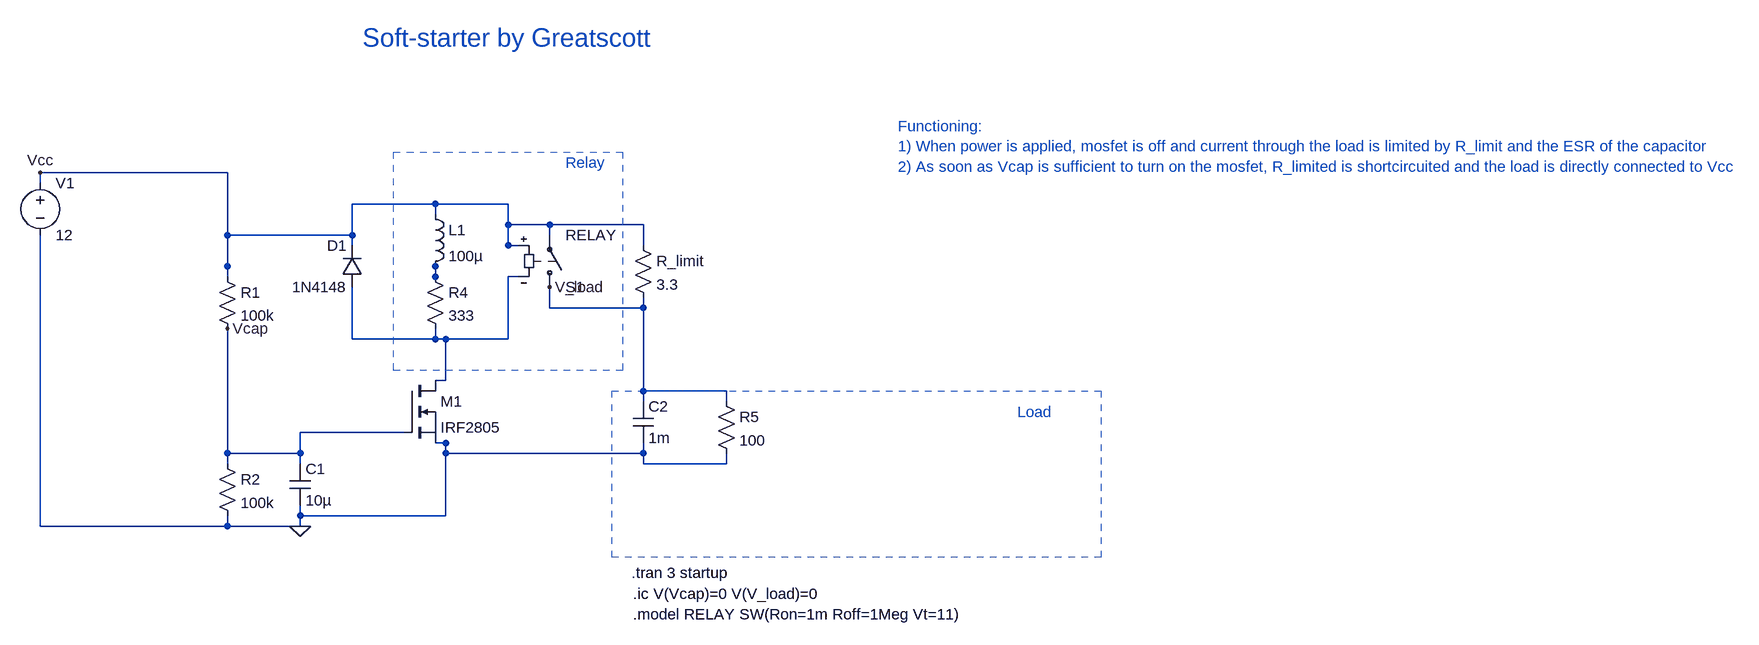
[diagram p0: schematic soft-starter-12V.asc]
soft-starter-12V.asc, the LTspice schematic file:
Version 4.1
SHEET 1 2440 680
WIRE 144 288 144 304
WIRE 672 192 672 208
WIRE 352 192 368 192
WIRE 32 304 32 320
WIRE 800 208 800 224
WIRE -256 -128 -256 -112
WIRE 144 304 144 320
WIRE 144 320 32 320
WIRE 144 304 368 304
WIRE 368 304 368 192
WIRE 368 192 368 208
WIRE 368 208 672 208
WIRE 672 208 672 224
WIRE 672 224 800 224
WIRE 32 320 -256 320
WIRE -256 320 -256 -112
FLAG 144 320 0
WIRE 352 -80 352 -64
WIRE 352 -64 352 -80
WIRE 224 -48 224 -32
WIRE 352 96 368 96
WIRE 352 16 352 32
WIRE 480 -64 464 -64
WIRE 224 -32 224 32
WIRE 224 32 352 32
WIRE 352 32 368 32
WIRE 368 32 368 96
WIRE 352 32 464 32
WIRE 464 32 464 -64
WIRE 672 128 672 112
WIRE 800 128 800 112
WIRE 672 -32 672 -16
WIRE 528 -48 528 -32
WIRE 672 112 672 -16
WIRE 672 112 800 112
WIRE 672 -16 528 -16
WIRE 528 -16 528 -32
FLAG 528 -48 V_load
WIRE 144 224 144 208
WIRE 304 176 288 176
WIRE 32 16 32 32
WIRE 32 224 32 208
WIRE 144 208 32 208
WIRE 32 208 32 32
WIRE 144 208 144 176
WIRE 144 176 288 176
FLAG 32 16 Vcap
WIRE 224 -112 224 -128
WIRE 352 -160 352 -176
WIRE 32 -64 32 -80
WIRE 672 -112 672 -128
WIRE 528 -128 528 -144
WIRE 480 -112 464 -112
WIRE -256 -208 -256 -224
WIRE 224 -128 224 -176
WIRE 224 -176 352 -176
WIRE 352 -176 464 -176
WIRE 464 -176 464 -112
WIRE 464 -112 464 -144
WIRE 464 -144 528 -144
WIRE 528 -144 672 -144
WIRE 672 -144 672 -128
WIRE 224 -128 32 -128
WIRE 32 -128 32 -80
WIRE 32 -80 32 -224
WIRE 32 -224 -256 -224
FLAG -256 -224 Vcc
SYMBOL res 16 -80 R0
SYMATTR InstName R1
SYMATTR Value 100k
SYMBOL res 16 208 R0
SYMATTR InstName R2
SYMATTR Value 100k
SYMBOL cap 128 224 R0
SYMATTR InstName C1
SYMATTR Value 10µ
SYMBOL nmos 304 96 R0
SYMATTR InstName M1
SYMATTR Value IRF2805
SYMBOL ind 336 -176 R0
SYMATTR InstName L1
SYMATTR Value 100µ
SYMBOL diode 240 -48 R180
WINDOW 0 24 64 Left 2
WINDOW 3 24 0 Left 2
SYMATTR InstName D1
SYMATTR Value 1N4148
SYMBOL res 656 -128 R0
SYMATTR InstName R_limit
SYMATTR Value 3.3
SYMBOL voltage -256 -224 R0
WINDOW 123 0 0 Left 0
WINDOW 39 0 0 Left 0
SYMATTR InstName V1
SYMATTR Value 12
SYMBOL sw 528 -32 M180
SYMATTR InstName S1
SYMATTR Value RELAY
SYMBOL res 336 -80 R0
SYMATTR InstName R4
SYMATTR Value 333
SYMBOL cap 656 128 R0
SYMATTR InstName C2
SYMATTR Value 1m
SYMBOL res 784 112 R0
SYMATTR InstName R5
SYMATTR Value 100
TEXT 654 392 Left 2 !.tran 3 startup
TEXT 656 456 Left 2 !.model RELAY SW(Ron=1m Roff=1Meg Vt=11)
TEXT 656 424 Left 2 !.ic V(Vcap)=0 V(V_load)=0
TEXT 552 -240 Left 2 ;Relay
TEXT 240 -432 Left 4 ;Soft-starter by Greatscott
TEXT 1248 144 Left 2 ;Load
TEXT 1064 -296 Left 2 ;Functioning:\n1) When power is applied, mosfet is off and current through the load is limited by R_limit and the ESR of the capacitor\n2) As soon as Vcap is sufficient to turn on the mosfet, R_limited is shortcircuited and the load is directly connected to Vcc
RECTANGLE Normal 640 80 288 -256 2
RECTANGLE Normal 1376 368 624 112 2

The netlist it stands for:
* soft-starter-12V.asc
R1 Vcc Vcap 100k
R2 Vcap 0 100k
C1 Vcap 0 10µ
M1 N002 Vcap 0 0 IRF2805
L1 Vcc N001 100µ
D1 N002 Vcc 1N4148
R_limit Vcc V_load 3.3
V1 Vcc 0 12
S1 V_load Vcc Vcc N002 RELAY
R4 N001 N002 333
C2 V_load 0 1m
R5 V_load 0 100
.model D D
.lib standard.dio
.model NMOS NMOS
.model PMOS PMOS
.lib standard.mos
.tran 3 startup
.model RELAY SW(Ron=1m Roff=1Meg Vt=11)
.ic V(Vcap)=0 V(V_load)=0
* Relay
* Soft-starter by Greatscott
* Load
* Functioning:
* 1) When power is applied, mosfet is off and current through the load is limited by R_limit and the ESR of the capacitor
* 2) As soon as Vcap is sufficient to turn on the mosfet, R_limited is shortcircuited and the load is directly connected to Vcc
.backanno
.end